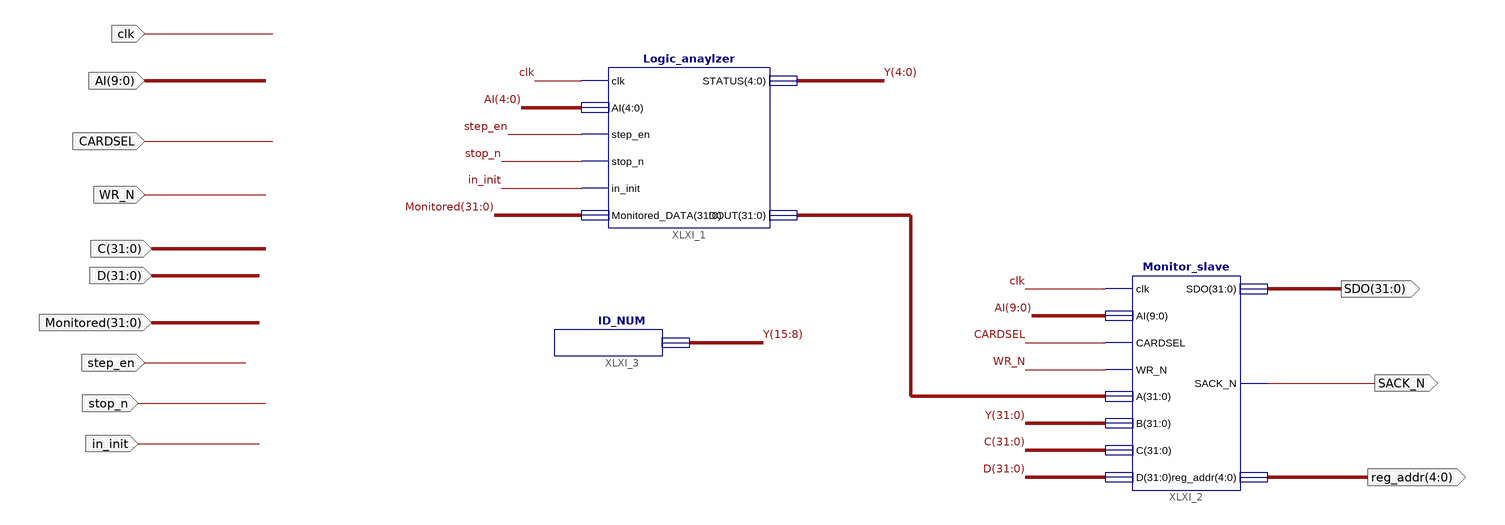
[diagram p0: schematic sheet 1]
// Xilinx ISE schematic Monitor.sch (spartan6) as structural Verilog: 3 symbols, 13 ports
module Monitor (
  input  clk,
  input  [9:0] AI,
  input  CARDSEL,
  input  WR_N,
  input  [31:0] C,
  input  [31:0] Monitored,
  input  [31:0] D,
  input  stop_n,
  input  step_en,
  input  in_init,
  output [31:0] SDO,
  output [4:0] reg_addr,
  output SACK_N
);

  wire [31:0] XLXN_13, Y;

  Logic_anaylzer XLXI_1 (
    .clk(clk), .AI(AI[4:0]), .step_en(step_en), .stop_n(stop_n), .in_init(in_init),
    .Monitored_DATA(Monitored), .STATUS(Y[4:0]), .DOUT(XLXN_13));
  Monitor_slave XLXI_2 (
    .clk(clk), .AI(AI), .CARDSEL(CARDSEL), .WR_N(WR_N), .A(XLXN_13), .B(Y), .C(C), .D(D), .SDO(SDO),
    .SACK_N(SACK_N), .reg_addr(reg_addr));
  ID_NUM XLXI_3 (.ID(Y[15:8]));
endmodule
